# EAGLE schematic SmartLamp_v0.2 (EAGLE 7.7.0)
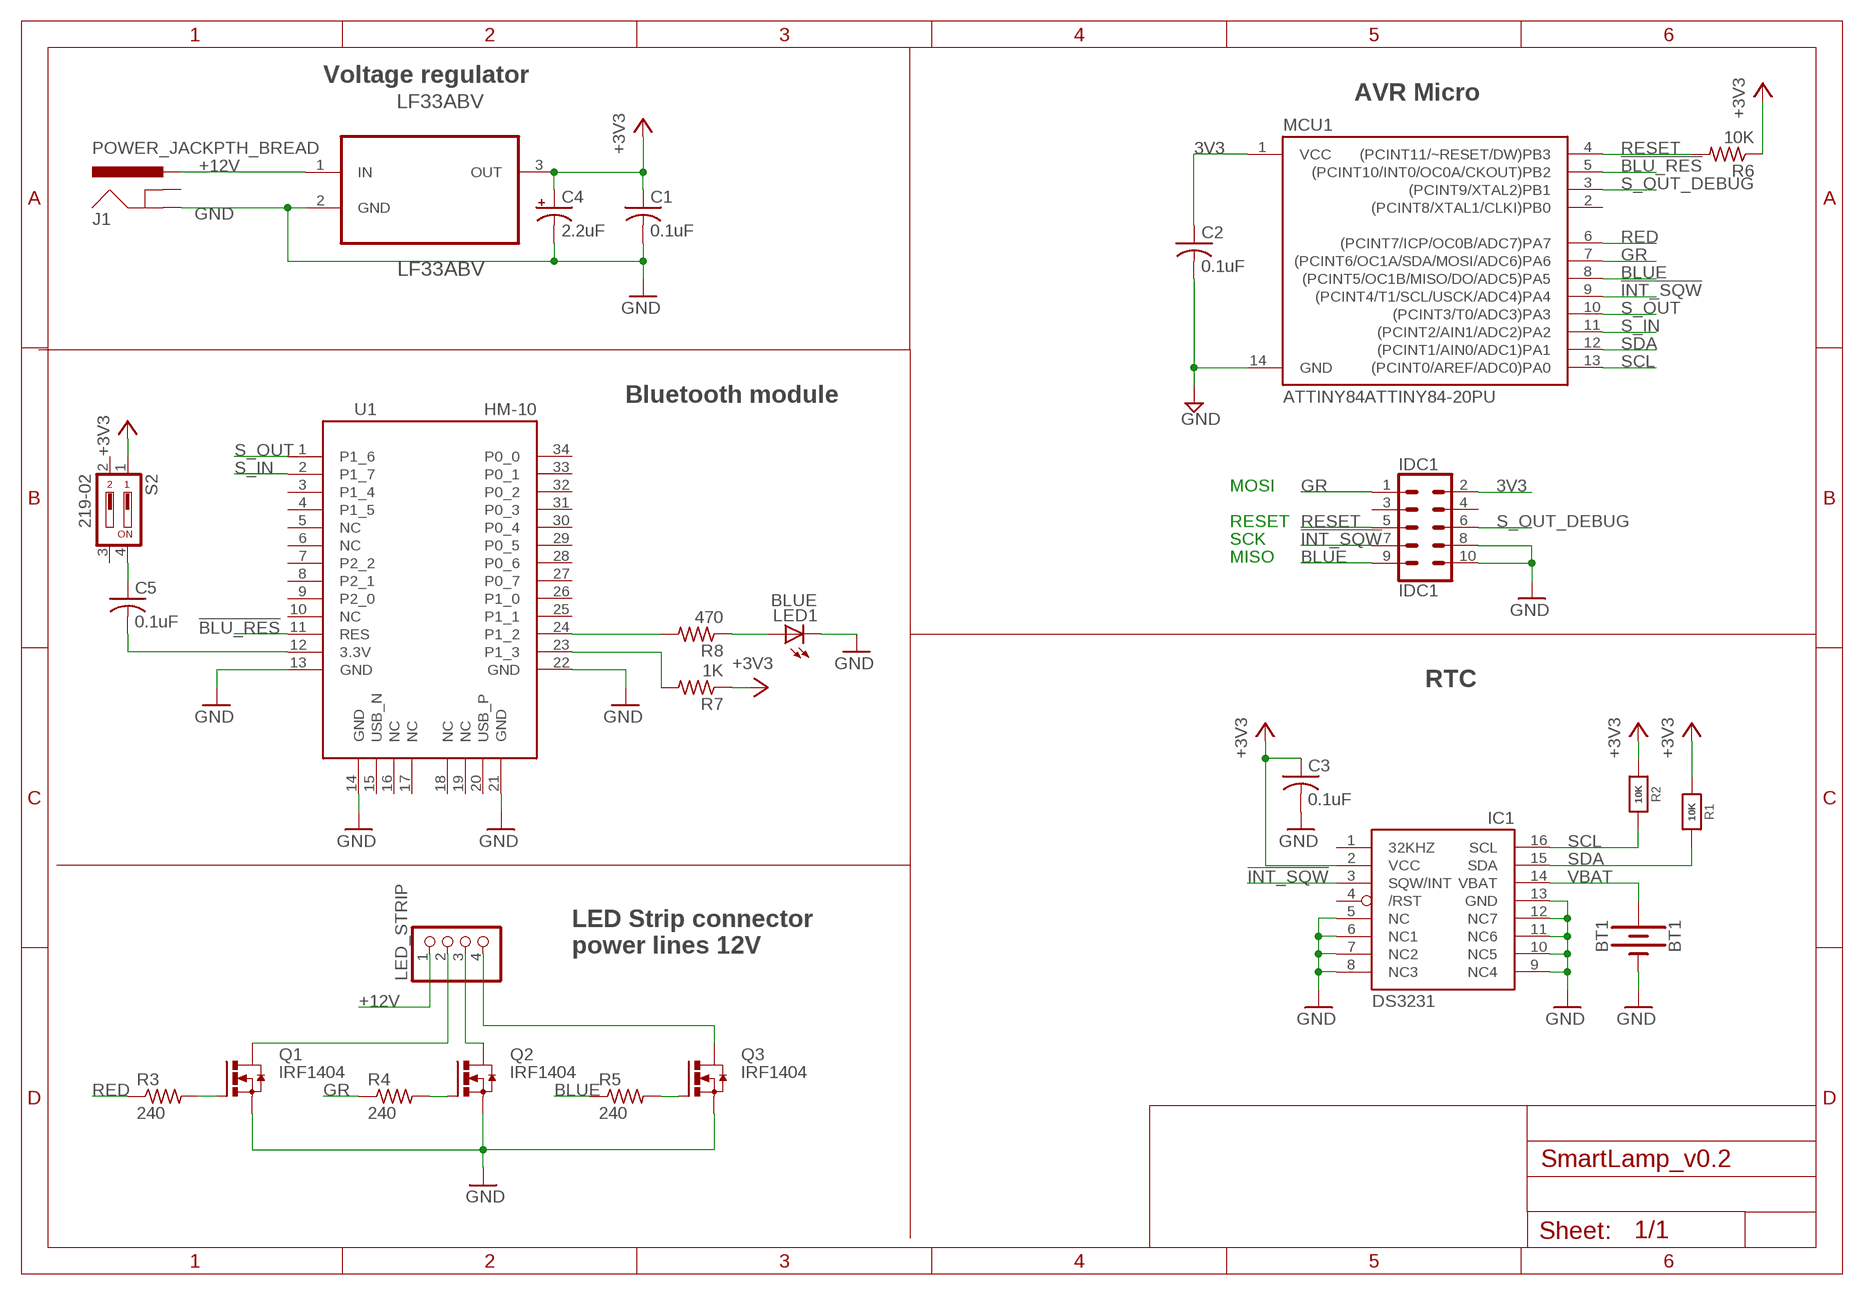
[diagram p0: schematic, sheet 1]

## Parts
BT1  BT1  BATTERY-20MM_SMD_4LEGS  [BATTCON_20MM_4LEGS]
C1  0.1uF  C-US025-024X044  [C025-024X044]
C2  0.1uF  C-US025-024X044  [C025-024X044]
C3  0.1uF  C-US025-024X044  [C025-024X044]
C4  2.2uF  CAP_POLPTH2  [CPOL-RADIAL-10UF-25V]
C5  0.1uF  C-US025-024X044  [C025-024X044]
IC1  DS3231/SO  [SO16W]
IDC1  IDC1  CONN_05X2SHD  [2X5-SHROUDED]
J1  POWER_JACKPTH_BREAD  [POWER_JACK_PTH_BREAD]
LED1  BLUE  LED3MM  [LED3MM]
LED_STRIP  PINHD-1X4  [1X04]
LF33ABV  LF33ABV  [TO254P450X1020X1935-3P]
MCU1  ATTINY84ATTINY84-20PU  [DIL14]
Q1  IRF1404  IRFI540NPBF  [TO220BH]
Q2  IRF1404  IRFI540NPBF  [TO220BH]
Q3  IRF1404  IRFI540NPBF  [TO220BH]
R1  10K  RESISTOR0805_NOOUTLINE  [0805-NO]
R2  10K  RESISTOR0805_NOOUTLINE  [0805-NO]
R3  240  R-US_0207/10  [0207/10]
R4  240  R-US_0207/10  [0207/10]
R5  240  R-US_0207/10  [0207/10]
R6  10K  R-US_0207/10  [0207/10]
R7  1K  R-US_0207/10  [0207/10]
R8  470  R-US_0207/10  [0207/10]
S2  219-02  [CTS-219-02]
U1  HM-10  [HM-10]

## Nets
3V3 [3.3V]: C2.1 IDC1.2 MCU1.1(VCC)
!BLU_RES: MCU1.5((PCINT10/INT0/OC0A/CKOUT)PB2) U1.11(RES)
!INT_SQW: IC1.3(SQW/INT) IDC1.7 MCU1.9((PCINT4/T1/SCL/USCK/ADC4)PA4)
+3V3 [3.3V]: C1.1 C3.1 C4.1(+) IC1.2(VCC) LF33ABV.3(OUT) R1.1 R2.1 R6.1 R7.1 S2.1
+12V [12V]: J1.PWR LED_STRIP.1 LF33ABV.1(IN)
BLUE: IDC1.9 MCU1.8((PCINT5/OC1B/MISO/DO/ADC5)PA5) R5.1
GND: BT1.NEGATIVE(-) C1.2 C2.2 C3.2 C4.2(-) IC1.5(NC) IC1.6(NC1) IC1.7(NC2) IC1.8(NC3) IC1.9(NC4) IC1.10(NC5) IC1.11(NC6) IC1.12(NC7) IC1.13(GND) IDC1.8 IDC1.10 J1.GND LED1.K(C) LF33ABV.2(GND) MCU1.14(GND) Q1.S Q2.S Q3.S U1.13(GND) U1.14(GND) U1.21(GND) U1.22(GND)
GR: IDC1.1 MCU1.7((PCINT6/OC1A/SDA/MOSI/ADC6)PA6) R4.1
N$1: C5.2 U1.12(3.3V)
N$2: C5.1 S2.4
N$3 [12V]: LED_STRIP.2 Q1.D
N$4 [12V]: LED_STRIP.3 Q2.D
N$6 [12V]: LED_STRIP.4 Q3.D
N$7: Q1.G R3.2
N$8: Q2.G R4.2
N$9: R8.2 U1.24(P1_2)
N$10: LED1.A R8.1
N$11: Q3.G R5.2
N$12: R7.2 U1.23(P1_3)
RED: MCU1.6((PCINT7/ICP/OC0B/ADC7)PA7) R3.1
RESET: IDC1.5 MCU1.4((PCINT11/~RESET/DW)PB3) R6.2
S_IN: MCU1.11((PCINT2/AIN1/ADC2)PA2) U1.2(P1_7)
S_OUT: MCU1.10((PCINT3/T0/ADC3)PA3) U1.1(P1_6)
S_OUT_DEBUG: IDC1.6 MCU1.3((PCINT9/XTAL2)PB1)
SCL: IC1.16(SCL) MCU1.13((PCINT0/AREF/ADC0)PA0) R2.2
SDA: IC1.15(SDA) MCU1.12((PCINT1/AIN0/ADC1)PA1) R1.2
VBAT: BT1.POSITIVE@1(+) BT1.POSITIVE@2(+) BT1.POSITIVE@3(+) BT1.POSITIVE@4(+) IC1.14(VBAT)
Unconnected: IC1.1(32KHZ) IC1.4(/RST) IDC1.3 IDC1.4 J1.GNDBREAK MCU1.2((PCINT8/XTAL1/CLKI)PB0) S2.2 S2.3 U1.3(P1_4) U1.4(P1_5) U1.5(NC) U1.6(NC) U1.7(P2_2) U1.8(P2_1) U1.9(P2_0) U1.10(NC) U1.15(USB_N) U1.16(NC) U1.17(NC) U1.18(NC) U1.19(NC) U1.20(USB_P) U1.25(P1_1) U1.26(P1_0) U1.27(P0_7) U1.28(P0_6) U1.29(P0_5) U1.30(P0_4) U1.31(P0_3) U1.32(P0_2) U1.33(P0_1) U1.34(P0_0)

## Notes on the sheet
- Voltage regulator
- AVR Micro
- Bluetooth module
- MOSI
- RESET
- SCK
- MISO
- RTC
- LED Strip connector
  power lines 12V

## Library data of the parts
BT1 = SparkFun-Batteries:BATTERY: Battery - Single Cell A variety of battery chemistries, sizes, and footprints. Device List: 20MM_PTH - Coin Cell Battery Holder - 20mm (PTH) <https://www.sparkfun.com/products/783> 6.8MM_PTH - Coin Cell Battery Holder - 6.8MM(SMD) <https://www.digikey.com/product-detail/en/seiko-instruments/MS621FE-FL11E/728-1057-ND/1889208?WT.srch=1&gclid=CNOQ5a6LzdQCFZS2wAodXCkE0g> 12MM_SMD - Coin Cell Battery Holder - 12mm (SMD) <https://www.sparkfun.com/products/10592> 12MM_PTH - Coin Cell Battery Holder - 12mm (PTH) <https://www.sparkfun.com/products/7948> 20MM_SMD - 20mm Coin Cell Battery Holder (SMD) (2 legs) Used on the Big Time Watch Kit <https://www.sparkfun.com/products/11734> 20MM_SMD_4LEGS - Coin Cell Battery Holder - 20mm (SMD) <https://www.sparkfun.com/products/11892> 20MM_SMD_4LEGS_OVERPASTE - Coin Cell Battery Holder - 20mm (SMD) <https://www.sparkfun.com/products/11892> (Over-paste on the legs) 24.5MM_PTH - Coin Cell Battery Holder - 24.5mm (PTH) <https://www.sparkfun.com/products/8863> 9V - 9V Battery Holder - PC Mount Used on the SparkFun SparkPunk Sound Kit <https://www.sparkfun.com/products/11177> and SparkFun SparkPunk Sequencer Kit <https://www.sparkfun.com/products/12707> 18650 - Battery Holder - 18650 (PTH) <https://www.sparkfun.com/products/13113> AA - Battery Holder - 1xAA (PTH) <https://www.sparkfun.com/products/7949> AAA - Battery Holder - 1xAAA (PTH) <https://www.sparkfun.com/products/12718> AA_KIT - Battery Holder - 1xAA (PTH) <https://www.sparkfun.com/products/7949> Special kit package - pads only have exposed copper on one side of the board. AAA_KIT - Battery Holder - 1xAAA (PTH) <https://www.sparkfun.com/products/12718> Special kit package - pads only have exposed copper on one side of the board.; PROD_ID: BATT-10373; SF_SKU: PRT-11892
C1-C3 C5 = adafruit:C-US: CAPACITOR, American symbol
C4 = SparkFun-Capacitors:CAP_POL: Capacitor Polarized These are standard SMD and PTH capacitors. Normally 10uF, 47uF, and 100uF in electrolytic and tantalum varieties. Always verify the external diameter of the through hole cap, it varies with capacity, voltage, and manufacturer. The EIA devices should be standard.
IC1 = adafruit:DS3231
IDC1 = SparkFun-Connectors:CONN_05X2: Multi connection point. Often used as Generic Header-pin footprint for 0.1 inch spaced/style header connections For AVR SPI programming port, see special device with nice symbol: "AVR_SPI_PROG_5x2.dev" You can populate with any combo of single row headers, but if you'd like an exact match, check these: 2x5 AVR ICSP Male Header <https://www.sparkfun.com/products/778> (PRT-00778) 2x5 Pin Shrouded Header <https://www.sparkfun.com/products/8506> (PRT-08506) On any of the 0.1 inch spaced packages, you can populate with these: Break Away Headers - Straight <https://www.sparkfun.com/products/116> (PRT-00116) Break Away Male Headers - Right Angle <https://www.sparkfun.com/products/553> (PRT-00553) Female Headers <https://www.sparkfun.com/products/115> (PRT-00115) Break Away Headers - Machine Pin <https://www.sparkfun.com/products/117> (PRT-00117) Break Away Female Headers - Swiss Machine Pin <https://www.sparkfun.com/products/743> (PRT-00743) Special note: the shrouded connector mates well with our 5x2 ribbon cables: 2x5 Pin IDC Ribbon Cable <https://www.sparkfun.com/products/8535> (PRT-08535); PROD_ID: CONN-08671; SF_ID: PRT-08506
J1 = SparkFun-Connectors:POWER_JACK: Power Jack Connector This is the standard 5.5mm barrel jack for power. The PTH is the most common, proven, reliable, footprint. The Slot footprint only works if the mill layer is transmitted to the PCB fab house so be warned. Here are the connectors we sell at SparkFun: DC Barrel Power Jack/Connector <https://www.sparkfun.com/products/119> (PRT-00119) DC Barrel Power Jack/Connector (SMD) <https://www.sparkfun.com/products/12748> (PRT-12748) DC Barrel Jack Adapter - Breadboard Compatible <https://www.sparkfun.com/products/10811> (PRT-10811) It is used on this SparkFun product (and many, many others): SparkFun RedBoard - Programmed with Arduino <https://www.sparkfun.com/products/12757> (DEV-12757) Also, if you need a mating power supply or connector, please check these out: Wall Adapter Power Supply - 9VDC 650mA <https://www.sparkfun.com/products/298> (TOL-00298) DC Barrel Jack Adapter - Male <https://www.sparkfun.com/products/10287> (PRT-10287); PROD_ID: PRT-10811
LED1 = adafruit:LED: LED OSRAM: - CHIPLED LG R971, LG N971, LY N971, LG Q971, LY Q971, LO R971, LY R971 LH N974, LH R974 LS Q976, LO Q976, LY Q976 LO Q996 - Hyper CHIPLED LW Q18S LB Q993, LB Q99A, LB R99A - SideLED LS A670, LO A670, LY A670, LG A670, LP A670 LB A673, LV A673, LT A673, LW A673 LH A674 LY A675 LS A676, LA A676, LO A676, LY A676, LW A676 LS A679, LY A679, LG A679 - Hyper Micro SIDELED® LS Y876, LA Y876, LO Y876, LY Y876 LT Y87S - SmartLED LW L88C, LW L88S LB L89C, LB L89S, LG L890 LS L89K, LO L89K, LY L89K LS L896, LA L896, LO L896, LY L896 - TOPLED LS T670, LO T670, LY T670, LG T670, LP T670 LSG T670, LSP T670, LSY T670, LOP T670, LYG T670 LG T671, LOG T671, LSG T671 LB T673, LV T673, LT T673, LW T673 LH T674 LS T676, LA T676, LO T676, LY T676, LB T676, LH T676, LSB T676, LW T676 LB T67C, LV T67C, LT T67C, LS T67K, LO T67K, LY T67K, LW E67C LS E67B, LA E67B, LO E67B, LY E67B, LB E67C, LV E67C, LT E67C LW T67C LS T679, LY T679, LG T679 LS T770, LO T770, LY T770, LG T770, LP T770 LB T773, LV T773, LT T773, LW T773 LH T774 LS E675, LA E675, LY E675, LS T675 LS T776, LA T776, LO T776, LY T776, LB T776 LHGB T686 LT T68C, LB T68C - Hyper Mini TOPLED® LB M676 - Mini TOPLED Santana® LG M470 LS M47K, LO M47K, LY M47K Source: http://www.osram.convergy.de/
LED_STRIP = pinhead:PINHD-1X4: PIN HEADER
LF33ABV = ST Microelctronics_By_element14_Batch_1:LF33ABV: Very low drop voltage regulators with inhibit; MPN: LF33ABV; OC_FARNELL: 1087184; OC_NEWARK: 26M0228; PACKAGE: TO-220; SUPPLIER: STMicroelectronics
MCU1 = SparkFun-DigitalIC:ATTINY84: Atmel 14-pin 2/4/8kB flash uC
Q1-Q3 = transistor-power:IRFI540NPBF: HEXFET Power MOISFET VDSS = 100V, RDS(on) = 0.052 Ohm, ID = 20A, VGS(th) = 2.0 -- 4.0V Source: http://www.irf.com/product-info/datasheets/data/irfi540npbf.pdf
R1 R2 = microbuilder:RESISTOR: Resistors For new designs, use the packages preceded by an '_' character since they are more reliable: The following footprints should be used on most boards: _0402 - Standard footprint for regular board layouts _0603 - Standard footprint for regular board layouts _0805 - Standard footprint for regular board layouts _1206 - Standard footprint for regular board layouts For extremely tight-pitch boards where space is at a premium, the following 'micro-pitch' footprints can be used (smaller pads, no silkscreen outline, etc.): _0402MP - Micro-pitch footprint for very dense/compact boards _0603MP - Micro-pitch footprint for very dense/compact boards _0805MP - Micro-pitch footprint for very dense/compact boards _1206MP - Micro-pitch footprint for very dense/compact boards
R3-R8 = rcl:R-US_: RESISTOR, American symbol
S2 = switch-dil:219-02*: Surface Mount DIP Switch Series 219 SMT CTS Electronic Components Sourc: www.ctscorp.com; OC_FARNELL: unknown; OC_NEWARK: unknown
U1 = HM-10_BLE:HM-10

## Net classes
1 12V: width 0.762 mm, drill 0.508 mm, clearance 0.559 mm
2 3.3V: width 0.127 mm, drill 0.127 mm, clearance 0.254 mm